# Altium project ESP32.PrjPcb
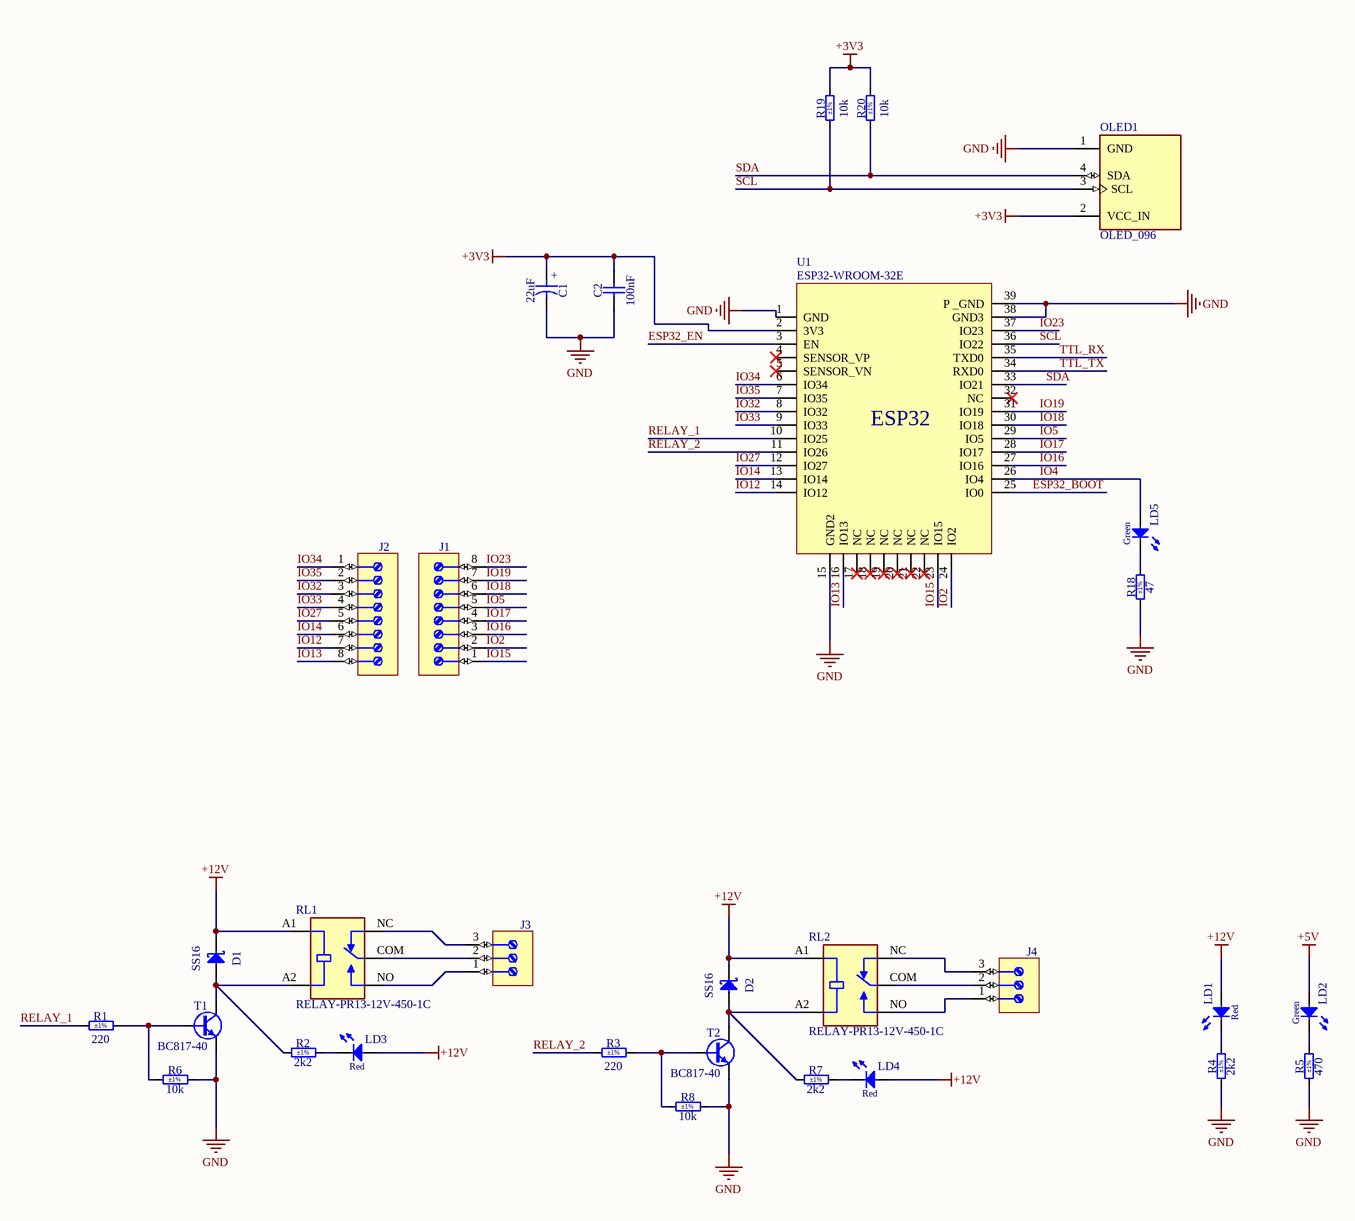
[diagram p0: Core.SchDoc]
3 sheets, 62 parts. Net scope: global (net labels, ports and power ports of the same name join across sheets).
Board file: PCB1.PcbDoc
Sheets:
  Core.SchDoc
  Power.SchDoc
  Com.SchDoc

## Sheet Core.SchDoc
size A3; SheetNumber: 1; SheetTotal: 3

### Parts
C1  22uF  [CAPMP3528X210N]
C2  100nF  [CAPC1608X87N]
D1  SS16  [DIOM5127X229N]
D2  SS16  [DIOM5127X229N]
J1  (no value)  [PHOENIX_1715789]
J2  (no value)  [PHOENIX_1715789]
J3  (no value)  [PHOENIX_1715734]
J4  (no value)  [PHOENIX_1715734]
LD1  Red  [LED_KINGBRIGHT_KPH-1608SURCK]
LD2  Green  [LED_KINGBRIGHT_KP-1608CGCK]
LD3  Red  [LED_KINGBRIGHT_KPH-1608SURCK]
LD4  Red  [LED_KINGBRIGHT_KPH-1608SURCK]
LD5  Green  [LED_KINGBRIGHT_KP-1608CGCK]
OLED1  OLED_096  [OLED096]
R1  220  Tolerance: ±1%  [RESC1608X55N]
R2  2k2  Tolerance: ±1%  [RESC1608X55N]
R3  220  Tolerance: ±1%  [RESC1608X55N]
R4  2k2  Tolerance: ±1%  [RESC1608X55N]
R5  470  Tolerance: ±1%  [RESC1608X55N]
R6  10k  Tolerance: ±1%  [RESC1608X55N]
R7  2k2  Tolerance: ±1%  [RESC1608X55N]
R8  10k  Tolerance: ±1%  [RESC1608X55N]
R18  47  Tolerance: ±1%  [RESC1608X55N]
R19  10k  Tolerance: ±1%  [RESC1608X55N]
R20  10k  Tolerance: ±1%  [RESC1608X55N]
RL1  RELAY-PR13-12V-450-1C  [RELAY_PR13-12V-450-1C]
RL2  RELAY-PR13-12V-450-1C  [RELAY_PR13-12V-450-1C]
T1  BC817-40  [SOT95P230X110-3N]
T2  BC817-40  [SOT95P230X110-3N]
U1  ESP32-WROOM-32E  [ESP32]

### Nets
+3V3: C1.1 C2.2 OLED1.2(VCC_IN) R19.2 R20.2 U1.2(3V3)
+5V: LD2.2(A)
+12V: D1.1(C) D2.1(C) LD1.2(A) LD3.2(A) LD4.2(A) RL1.A1(COIL1) RL2.A1(COIL1)
GND: C1.2 C2.1 OLED1.1(GND) R4.1 R5.1 R6.2 R8.2 R18.1 T1.2(E) T2.2(E) U1.1(GND) U1.15(GND2) U1.38(GND3) U1.39(P__GND)
ESP32_BOOT: U1.25(IO0)
ESP32_EN: U1.3(EN)
IO2: J1.2 U1.24(IO2)
IO4: LD5.2(A) U1.26(IO4)
IO5: J1.5 U1.29(IO5)
IO12: J2.7 U1.14(IO12)
IO13: J2.8 U1.16(IO13)
IO14: J2.6 U1.13(IO14)
IO15: J1.1 U1.23(IO15)
IO16: J1.3 U1.27(IO16)
IO17: J1.4 U1.28(IO17)
IO18: J1.6 U1.30(IO18)
IO19: J1.7 U1.31(IO19)
IO23: J1.8 U1.37(IO23)
IO27: J2.5 U1.12(IO27)
IO32: J2.3 U1.8(IO32)
IO33: J2.4 U1.9(IO33)
IO34: J2.1 U1.6(IO34)
IO35: J2.2 U1.7(IO35)
RELAY_1: R1.1 U1.10(IO25)
RELAY_2: R3.1 U1.11(IO26)
SCL: OLED1.3(SCL) R19.1 U1.36(IO22)
SDA: OLED1.4(SDA) R20.1 U1.33(IO21)
TTL_RX: U1.35(TXD0)
TTL_TX: U1.34(RXD0)
NetD1_2: D1.2(A) R2.1 RL1.A2(COIL2) T1.3(C)
NetD2_2: D2.2(A) R7.1 RL2.A2(COIL2) T2.3(C)
NetJ3_1: J3.1 RL1.NO
NetJ3_2: J3.2 RL1.COM
NetJ3_3: J3.3 RL1.NC
NetJ4_1: J4.1 RL2.NO
NetJ4_2: J4.2 RL2.COM
NetJ4_3: J4.3 RL2.NC
NetLD1_1: LD1.1(C) R4.2
NetLD2_1: LD2.1(C) R5.2
NetLD3_1: LD3.1(C) R2.2
NetLD4_1: LD4.1(C) R7.2
NetLD5_1: LD5.1(C) R18.2
NetR1_2: R1.2 R6.1 T1.1(B)
NetR3_2: R3.2 R8.1 T2.1(B)

Not connected (* = marked no-connect by the designer): U1 4(SENSOR_VP)* 5(SENSOR_VN)* 17(NC)* 18(NC)* 19(NC)* 20(NC)* 21(NC)* 22(NC)* 32(NC)*

### Notes on the sheet
- (in symbol CTE3528-21_22UF_10V_10%_LESR0700) +
- (in symbol ESP32-WROOM-32E) ESP32

### Library data of the parts
C1 = CTE3528-21_22UF_10V_10%_LESR0700: Polarised capacitor; Part Description: Low ESR 0R7 Solid Tantalum Chip Capacitor; Manufacturer: GENERIC; Manufacturer1 Part Number: TPSB226K010R0700; Voltage: 10V; Tolerance: ±10%; Part Number: CTE3528-21_22UF_10V_10%_LESR0700; Component Kind: Standard; Component Type: Standard; Pin Count: 2; Value: 22uF; Status: Preferred; Manufacturer Part Number: CTE3528-21_22UF_10V_10%_LESR0700; Case: B; Mounted: Yes; Socket: No; SMD: Yes; Sense: No; Manufacturer1 Example: AVX; Manufacturer1 ComponentHeight: 2.1mm; HelpURL: \\cern.ch\dfs\Applications\Altium\Datasheets\CTE-LESR_AVX_TPS.pdf; Author: CERN DEM JLC; CreateDate: 5.05.2008; LatestRevisionDate: 20.01.2009
C2 = CC0603_100NF_50V_10%_X5R: Non-polarised capacitor; Part Description: SMD Multilayer Chip Ceramic Capacitor; Manufacturer: GENERIC; Manufacturer1 Part Number: C1608X5R1H104K080; Voltage: 50V; TC: X5R; Tolerance: ±10%; Part Number: CC0603_100NF_50V_10%_X5R; Component Kind: Standard; Component Type: Standard; Pin Count: 2; Value: 100nF; Status: None; Manufacturer Part Number: CC0603_100NF_50V_10%_X5R; Case: 0603; Mounted: Yes; Socket: No; SMD: Yes; Sense: No; Manufacturer1 Example: TDK; Manufacturer1 ComponentHeight: 0.9mm; HelpURL: \\cern.ch\dfs\Applications\Altium\Datasheets\CC0603_X5R_TDK_C.pdf; Author: CERN DEM MR; CreateDate: 8.01.2016; LatestRevisionDate: 8.01.2016
D1 D2 = SS16: Schottky Diode; Part Description: Surface Mount Schottky Barrier Rectifier; Manufacturer: VISHAY GENERAL SEMICONDUCTOR; Voltage: 60V; Power: 1A; PressFit: No; Bonding: No; Part Number: SS16; Component Kind: Standard; Component Type: Standard; Device: SS16; PackageDescription: DO-214-AC/SMA Diode, Molded Body; 5.10mm L X 2.67mm W X 2.29mm H, IPC Medium Density; Manufacturer Part Number: SS16; Pin Count: 2; Case: DO-214AC; Mounted: Yes; Socket: No; SMD: Yes; Sense: No; ComponentHeight: 2.29mm; HelpURL: \\cern.ch\dfs\Applications\Altium\Datasheets\SS16.pdf; Author: CERN DEM JLC; CreateDate: 15.07.2008; LatestRevisionDate: 23.08.2010
J1 J2 = PHOENIX_1715789: Terminal Block, 8 Positions, Screw Connection; Part Description: 17.5A, 400V, Terminal Block, Pitch 5.08mm, 8 Positions, Screw Connection; Manufacturer: PHOENIX CONTACT; Manufacturer Part Number: 1715789 (MKDS 1,5/8-5,08); PressFit: No; Part Number: PHOENIX_1715789; Component Kind: Standard; Component Type: Standard; Pin Count: 8; Mounted: Yes; Socket: No; SMD: No; Sense: No; Status: None; ComponentHeight: 13.8mm; HelpURL: \\cern.ch\dfs\Applications\Altium\Datasheets\PHOENIX_1715789.pdf; Author: CERN DEM JMW; CreateDate: 25.02.2013; LatestRevisionDate: 25.02.2013
J3 J4 = PHOENIX_1715734: Terminal Block, 3 Positions, Screw Connection; Part Description: 17.5A, 400V, Terminal Block, Pitch 5.08mm, 3 Positions, Screw Connection; Manufacturer: PHOENIX CONTACT; Manufacturer Part Number: 1715734 (MKDS 1,5/3-5,08); PressFit: No; Part Number: PHOENIX_1715734; Component Kind: Standard; Component Type: Standard; Pin Count: 3; Mounted: Yes; Socket: No; SMD: No; Sense: No; Status: None; ComponentHeight: 13.8mm; HelpURL: \\cern.ch\dfs\Applications\Altium\Datasheets\PHOENIX_1715734.pdf; Author: CERN DEM JLC; CreateDate: 6.01.2010; LatestRevisionDate: 25.02.2013
LD1 LD3 LD4 = LED_KINGBRIGHT_KPH-1608SURCK: LED Red 1C 2A; Part Description: SMD Hyper Red LED, Case 1.6mmX0.8mm(0603), 0.65mm Thickness; PressFit: No; Bonding: No; Part Number: LED_KINGBRIGHT_KPH-1608SURCK; Component Kind: Standard; Component Type: Standard; Color: Red; PackageDescription: SMT Hyper Red LED, Case 0603, Body L 1.6 x W 0.8mm H 0.65mm; Manufacturer: KINGBRIGHT; Manufacturer Part Number: KPH-1608SURCK; Pin Count: 2; Case: 0603; Mounted: Yes; Socket: No; SMD: Yes; Sense: No; ComponentHeight: 0.65mm; HelpURL: \\cern.ch\dfs\Applications\Altium\Datasheets\LED_KINGBRIGHT_KPH-1608SURCK.pdf; Author: CERN DEM JLC; CreateDate: 3.07.2017; LatestRevisionDate: 3.07.2017
LD2 LD5 = LED_KINGBRIGHT_KP-1608CGCK: LED Green 1C 2A; Part Description: 1.6x0.8mm SMD Chip Green LED Lamp; PressFit: No; Bonding: No; Part Number: LED_KINGBRIGHT_KP-1608CGCK; Component Kind: Standard; Component Type: Standard; Color: Green; PackageDescription: SMT Green LED, Case 0603, Body L 1.60mm x W 0.80mm x H 1.10mm; Manufacturer: KINGBRIGHT; Manufacturer Part Number: KP-1608CGCK; Pin Count: 2; Case: 0603; Mounted: Yes; Socket: No; SMD: Yes; Sense: No; ComponentHeight: 1.1mm; HelpURL: \\cern.ch\dfs\Applications\Altium\Datasheets\LED_KINGBRIGHT_KP-1608CGCK.pdf; Author: CERN DEM HF; CreateDate: 1.10.2021; LatestRevisionDate: 1.10.2021
R1 R3 = R0603_220R_1%_0.1W_100PPM: Resistor - 1%; Part Description: General Purpose Thick Film Chip Resistor; Manufacturer: GENERIC; Manufacturer1 Part Number: NRC06F2200TRF; Power: 0.1W; TC: ±100ppm/°C; PressFit: No; Part Number: R0603_220R_1%_0.1W_100PPM; Component Kind: Standard; Component Type: Standard; Pin Count: 2; Value: 220; Status: Preferred; Manufacturer Part Number: R0603_220R_1%_0.1W_100PPM; Case: 0603; Mounted: Yes; Sense: No; Socket: No; SMD: Yes; Manufacturer1 Example: NIC COMPONENT; Manufacturer1 ComponentHeight: 0.55mm; HelpURL: \\cern.ch\dfs\Applications\Altium\Datasheets\R0603_NIC_NRC.pdf; Author: CERN DEM JLC; CreateDate: 3.12.2007; LatestRevisionDate: 13.03.2008
R2 R4 R7 = R0603_2K2_1%_0.1W_100PPM: Resistor - 1%; Part Description: General Purpose Thick Film Chip Resistor; Manufacturer: GENERIC; Manufacturer1 Part Number: NRC06F2201TRF; Power: 0.1W; TC: ±100ppm/°C; PressFit: No; Part Number: R0603_2K2_1%_0.1W_100PPM; Component Kind: Standard; Component Type: Standard; Pin Count: 2; Value: 2k2; Status: Preferred; Manufacturer Part Number: R0603_2K2_1%_0.1W_100PPM; Case: 0603; Mounted: Yes; Sense: No; Socket: No; SMD: Yes; Manufacturer1 Example: NIC COMPONENT; Manufacturer1 ComponentHeight: 0.55mm; HelpURL: \\cern.ch\dfs\Applications\Altium\Datasheets\R0603_NIC_NRC.pdf; Author: CERN DEM JLC; CreateDate: 3.12.2007; LatestRevisionDate: 13.03.2008
R5 = R0603_470R_1%_0.1W_100PPM: Resistor - 1%; Part Description: General Purpose Thick Film Chip Resistor; Manufacturer: GENERIC; Manufacturer1 Part Number: NRC06F4700TRF; Power: 0.1W; TC: ±100ppm/°C; PressFit: No; Part Number: R0603_470R_1%_0.1W_100PPM; Component Kind: Standard; Component Type: Standard; Pin Count: 2; Value: 470; Status: Preferred; Manufacturer Part Number: R0603_470R_1%_0.1W_100PPM; Case: 0603; Mounted: Yes; Sense: No; Socket: No; SMD: Yes; Manufacturer1 Example: NIC COMPONENT; Manufacturer1 ComponentHeight: 0.55mm; HelpURL: \\cern.ch\dfs\Applications\Altium\Datasheets\R0603_NIC_NRC.pdf; Author: CERN DEM JLC; CreateDate: 3.12.2007; LatestRevisionDate: 13.03.2008
R6 R8 R19 R20 = R0603_10K_1%_0.1W_100PPM: Resistor - 1%; Part Description: General Purpose Thick Film Chip Resistor; Manufacturer: GENERIC; Manufacturer1 Part Number: NRC06F1002TRF; Power: 0.1W; TC: ±100ppm/°C; PressFit: No; Part Number: R0603_10K_1%_0.1W_100PPM; Component Kind: Standard; Component Type: Standard; Pin Count: 2; Value: 10k; Status: Preferred; Manufacturer Part Number: R0603_10K_1%_0.1W_100PPM; Case: 0603; Mounted: Yes; Sense: No; Socket: No; SMD: Yes; Manufacturer1 Example: NIC COMPONENT; Manufacturer1 ComponentHeight: 0.55mm; HelpURL: \\cern.ch\dfs\Applications\Altium\Datasheets\R0603_NIC_NRC.pdf; Author: CERN DEM JLC; CreateDate: 3.12.2007; LatestRevisionDate: 13.03.2008
R18 = R0603_47R_1%_0.1W_100PPM: Resistor - 1%; Part Description: General Purpose Thick Film Chip Resistor; Manufacturer: GENERIC; Manufacturer1 Part Number: NRC06F47R0TRF; Power: 0.1W; TC: ±100ppm/°C; PressFit: No; Part Number: R0603_47R_1%_0.1W_100PPM; Component Kind: Standard; Component Type: Standard; Pin Count: 2; Value: 47; Status: Preferred; Manufacturer Part Number: R0603_47R_1%_0.1W_100PPM; Case: 0603; Mounted: Yes; Sense: No; Socket: No; SMD: Yes; Manufacturer1 Example: NIC COMPONENT; Manufacturer1 ComponentHeight: 0.55mm; HelpURL: \\cern.ch\dfs\Applications\Altium\Datasheets\R0603_NIC_NRC.pdf; Author: CERN DEM JLC; CreateDate: 3.12.2007; LatestRevisionDate: 13.03.2008
T1 T2 = BC817-40: NPN Transistor; Part Description: 45V 500mA NPN General-Purpose Transistor; Manufacturer: NXP SEMICONDUCTORS; PressFit: No; Bonding: No; Part Number: BC817-40; Component Kind: Standard; Component Type: Standard; Device: BC817-40; PackageDescription: SOT23, 0.95mm Pitch; 3 Pin, 1.30mm W X 2.90mm L X 1.10mm H body, IPC Medium Density; Manufacturer Part Number: BC817-40; Pin Count: 3; Case: SOT23-3; Mounted: Yes; Socket: No; SMD: Yes; Sense: No; ComponentHeight: 1.1mm; HelpURL: \\cern.ch\dfs\Applications\Altium\Datasheets\BC817-40.pdf; Author: CERN DEM BC; CreateDate: 29.04.2020; LatestRevisionDate: 29.04.2020

## Sheet Power.SchDoc
size A4; SheetNumber: 2; SheetTotal: 3
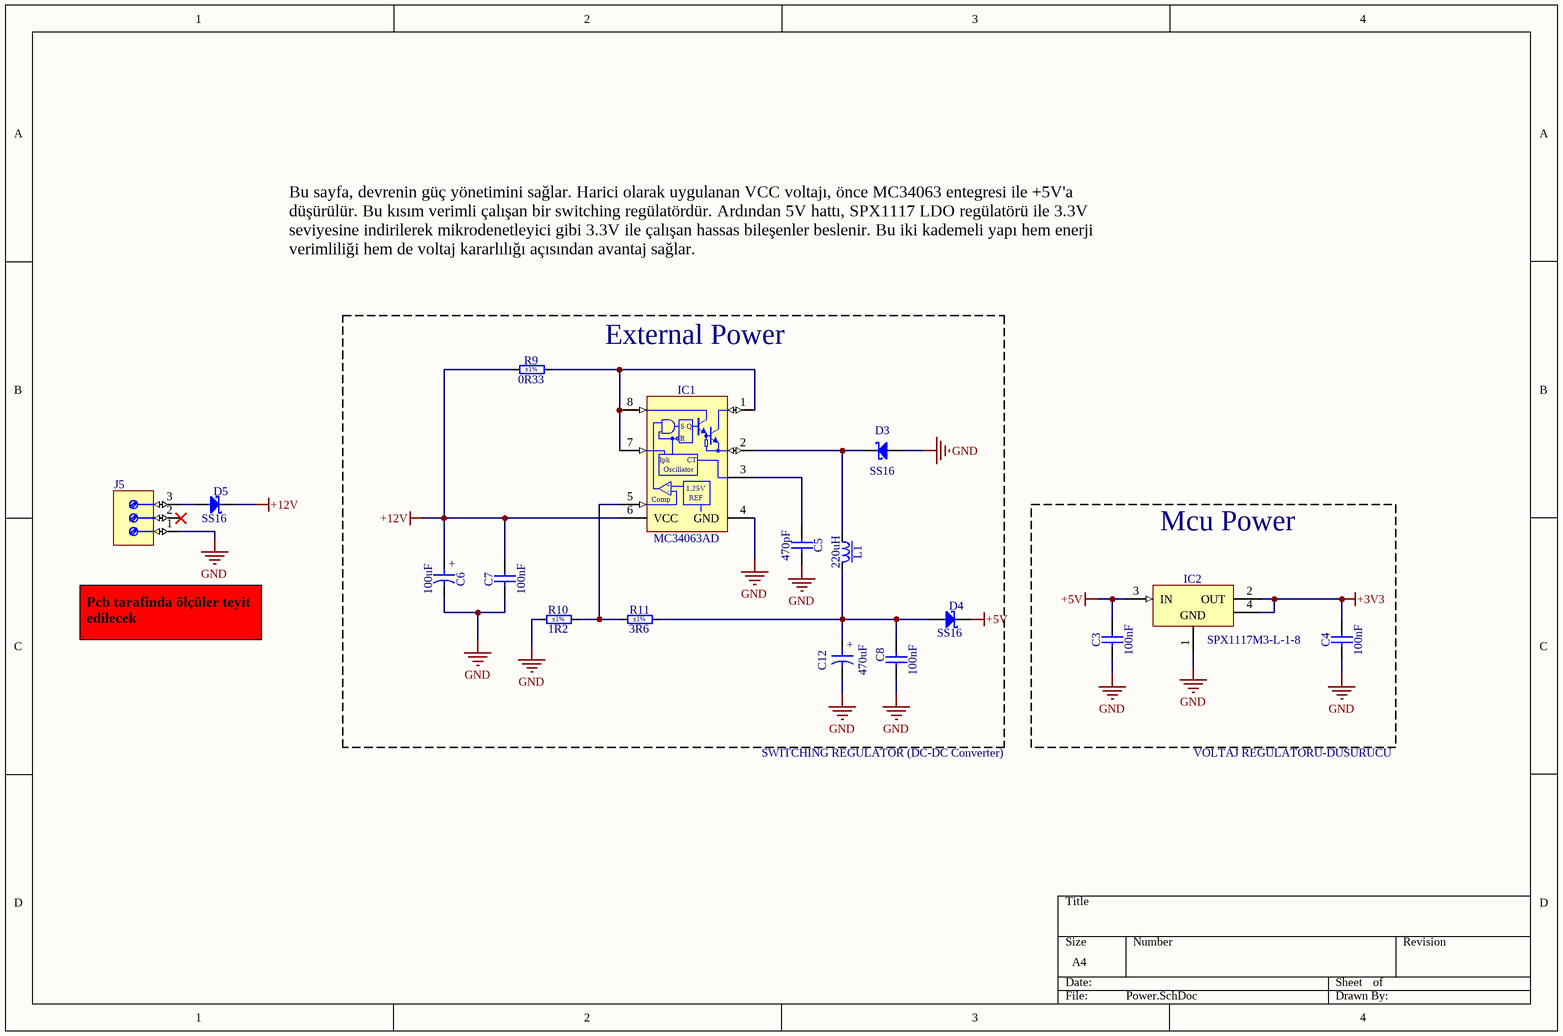
[diagram p1: Power.SchDoc]

### Parts
C3  100nF  [CAPC1608X87N]
C4  100nF  [CAPC1608X87N]
C5  470pF  [CAPC1608X87N]
C6  100uF  [CAPMP7343X430N]
C7  100nF  [CAPC1608X87N]
C8  100nF  [CAPC1608X87N]
C12  470uF  [CAPMP7343X310N]
D3  SS16  [DIOM5127X229N]
D4  SS16  [DIOM5127X229N]
D5  SS16  [DIOM5127X229N]
IC1  MC34063AD  [SOIC127P600X175-8N]
IC2  SPX1117M3-L-1-8  [SOT230P700X180-4N]
J5  (no value)  [PHOENIX_1715734]
L1  220uH  [IND_EPCOS_B82464-G4]
R9  0R33  Tolerance: ±1%  [RESC3216X65N]
R10  1R2  Tolerance: ±1%  [RESC1608X55N]
R11  3R6  Tolerance: ±1%  [RESC1608X55N]

### Blocks framed on the sheet
External Power: C5-C8 C12 D3 D4 IC1 L1 R9-R11
Mcu Power: C3 C4 IC2

### Nets
+3V3: C4.2 IC2.2(OUT) IC2.4(OUT)
+5V: C3.2 D4.1(C) IC2.3(IN)
+12V: C6.1 C7.2 D5.1(C) IC1.6(VCC) R9.1
GND: C3.1 C4.1 C5.2 C6.2 C7.1 C8.1 C12.2 D3.2(A) IC1.4(GND) IC2.1(GND) J5.1 R10.1
NetC5_1: C5.1 IC1.3(TC)
NetC8_2: C8.2 C12.1 D4.2(A) L1.2 R11.2
NetD3_1: D3.1(C) IC1.2(SWE) L1.1
NetD5_2: D5.2(A) J5.3
NetIC1_1: IC1.1(SWC) IC1.7(Ipk) IC1.8(DRVC) R9.2
NetIC1_5: IC1.5(COMP) R10.2 R11.1

Not connected (* = marked no-connect by the designer): J5 2*

### Notes on the sheet
- Bu sayfa, devrenin güç yönetimini sağlar. Harici olarak uygulanan VCC voltajı, önce MC34063 entegresi ile +5V'a düşürülür. Bu kısım verimli çalışan bir switching regülatördür. Ardından 5V hattı, SPX1117 LDO regülatörü ile 3.3V seviyesine indirilerek mikrodenetleyici gibi 3.3V ile çalışan hassas bileşenler beslenir. Bu iki kademeli yapı hem enerji verimliliği hem de voltaj kararlılığı açısından avantaj sağlar.
- Pcb tarafinda ölçüler teyit edilecek
- SWITCHING REGULATOR (DC-DC Converter)
- VOLTAJ REGULATORU-DUSURUCU
- (in symbol CTE7343-31_470UF_6.3V_10%) +
- (in symbol CTE7343-43_100UF_20V_10%_LESR0150) +
- (in symbol MC34063AD) S; Q; R; CT; Oscillator; +; -; 1.25V; Comp; REF

### Library data of the parts
C3 C4 C7 C8 = CC0603_100NF_50V_10%_X5R: as C2 on sheet Core; Part Number: CC0603_100NF_50V_10%_X5R; Component Kind: Standard; Component Type: Standard; Pin Count: 2; Value: 100nF; Status: None; Manufacturer Part Number: CC0603_100NF_50V_10%_X5R; Case: 0603; Mounted: Yes; Socket: No; SMD: Yes; Sense: No; Manufacturer1 Example: TDK; Manufacturer1 ComponentHeight: 0.9mm; HelpURL: \\cern.ch\dfs\Applications\Altium\Datasheets\CC0603_X5R_TDK_C.pdf; Author: CERN DEM MR; CreateDate: 8.01.2016; LatestRevisionDate: 8.01.2016
C5 = CC0603_470PF_50V_5%_NP0: Non-polarised capacitor; Part Description: SMD Multilayer Chip Ceramic Capacitor; Manufacturer: GENERIC; Manufacturer1 Part Number: 223886715471; Voltage: 50V; TC: C0G/NP0; Tolerance: ±5%; Part Number: CC0603_470PF_50V_5%_NP0; Component Kind: Standard; Component Type: Standard; Pin Count: 2; Value: 470pF; Status: Preferred; Manufacturer Part Number: CC0603_470PF_50V_5%_NP0; Case: 0603; Mounted: Yes; Socket: No; SMD: Yes; Sense: No; Manufacturer1 Example: PHYCOMP; Manufacturer1 ComponentHeight: 0.87mm; HelpURL: \\cern.ch\dfs\Applications\Altium\Datasheets\CC0603_NP0_PHYCOMP.pdf; Author: CERN DEM JLC; CreateDate: 3.12.2007; LatestRevisionDate: 3.12.2007
C6 = CTE7343-43_100UF_20V_10%_LESR0150: Polarised capacitor; Part Description: Low ESR 0R15 Solid Tantalum Chip Capacitor; Manufacturer: GENERIC; Manufacturer1 Part Number: TPSE107K020R0150; Voltage: 20V; Tolerance: ±10%; Part Number: CTE7343-43_100UF_20V_10%_LESR0150; Component Kind: Standard; Component Type: Standard; Pin Count: 2; Value: 100uF; Status: Preferred; Manufacturer Part Number: CTE7343-43_100UF_20V_10%_LESR0150; Case: E; Mounted: Yes; Socket: No; SMD: Yes; Sense: No; Manufacturer1 Example: AVX; Manufacturer1 ComponentHeight: 4.3mm; HelpURL: \\cern.ch\dfs\Applications\Altium\Datasheets\CTE-LESR_AVX_TPS.pdf; Author: CERN DEM JLC; CreateDate: 5.05.2008; LatestRevisionDate: 20.01.2009
C12 = CTE7343-31_470UF_6.3V_10%: Polarised capacitor; Part Description: Solid Tantalum Chip Capacitor; Manufacturer: GENERIC; Manufacturer1 Part Number: TAJD477K006R; Voltage: 6.3V; Tolerance: ±10%; Part Number: CTE7343-31_470UF_6.3V_10%; Component Kind: Standard; Component Type: Standard; Pin Count: 2; Value: 470uF; Status: Preferred; Manufacturer Part Number: CTE7343-31_470UF_6.3V_10%; Case: D; Mounted: Yes; Socket: No; SMD: Yes; Sense: No; Manufacturer1 Example: AVX; Manufacturer1 ComponentHeight: 3.1mm; HelpURL: \\cern.ch\dfs\Applications\Altium\Datasheets\CTE_AVX_TAJ.pdf; Author: CERN DEM JLC; CreateDate: 3.12.2007; LatestRevisionDate: 3.12.2007
D3-D5 = SS16: as D1 on sheet Core; Part Number: SS16; Component Kind: Standard; Component Type: Standard; Device: SS16; PackageDescription: DO-214-AC/SMA Diode, Molded Body; 5.10mm L X 2.67mm W X 2.29mm H, IPC Medium Density; Manufacturer Part Number: SS16; Pin Count: 2; Case: DO-214AC; Mounted: Yes; Socket: No; SMD: Yes; Sense: No; ComponentHeight: 2.29mm; HelpURL: \\cern.ch\dfs\Applications\Altium\Datasheets\SS16.pdf; Author: CERN DEM JLC; CreateDate: 15.07.2008; LatestRevisionDate: 23.08.2010
IC1 = MC34063AD: 3V to 40V 1.5A Peak Boost/Buck/Inverting Switching Regulator; Manufacturer: TEXAS INSTRUMENTS; PressFit: No; Bonding: No; Part Number: MC34063AD; Component Kind: Standard; Component Type: Standard; Device: MC34063AD; PackageDescription: SOIC 8, Pitch 1.27mm, Body 4x5mm, IPC Medium Density; Part Description: 3V to 40V 1.5A Peak Boost/Buck/Inverting Switching Regulator; Manufacturer Part Number: MC34063AD; Pin Count: 8; Case: SOIC8; Mounted: Yes; Socket: No; SMD: Yes; Sense: No; ComponentHeight: 1.75mm; HelpURL: \\cern.ch\dfs\Applications\Altium\Datasheets\MC34063AD.pdf; Author: CERN DEM JLC; CreateDate: 27.10.2009; LatestRevisionDate: 27.10.2009
IC2 = SPX1117M3-L-1-8: 3-Terminal Regulator 1=GND 2=OUT 3=IN 4=OUT; Part Description: 1.8V 800mA Low Dropout Voltage Regulator; Manufacturer: EXAR; PressFit: No; Bonding: No; Part Number: SPX1117M3-L-1-8; Component Kind: Standard; Component Type: Standard; Device: SPX1117M3-L-1-8; PackageDescription: SOT223, 2.30mm Pitch; 4 Pin, 3.70mm W X 6.70mm L X 1.80mm H body, IPC Medium Density; Manufacturer Part Number: SPX1117M3-L-1-8; Pin Count: 4; Case: SOT223; Mounted: Yes; Socket: No; SMD: Yes; Sense: No; ComponentHeight: 1.8mm; HelpURL: \\cern.ch\dfs\Applications\Altium\Datasheets\SPX1117M3-L-1-8.pdf; Author: CERN DEM JLC; CreateDate: 5.07.2011; LatestRevisionDate: 5.07.2011
J5 = PHOENIX_1715734: as J3 on sheet Core; Part Number: PHOENIX_1715734; Component Kind: Standard; Component Type: Standard; Pin Count: 3; Mounted: Yes; Socket: No; SMD: No; Sense: No; Status: None; ComponentHeight: 13.8mm; HelpURL: \\cern.ch\dfs\Applications\Altium\Datasheets\PHOENIX_1715734.pdf; Author: CERN DEM JLC; CreateDate: 6.01.2010; LatestRevisionDate: 25.02.2013
L1 = IND_470UH_20%_EPCOS_B82464-G4: Inductor With Core; Part Description: SMT Power Inductor; Manufacturer: EPCOS; Manufacturer Part Number: B82464–G4474–M; Value: 470uH; Power: 0.5A; Resistance: 0.93R; Tolerance: ±20%; Part Number: IND_470UH_20%_EPCOS_B82464-G4; Component Kind: Standard; Component Type: Standard; Pin Count: 2; Mounted: Yes; Socket: No; SMD: Yes; Sense: No; ComponentHeight: 4.8mm; HelpURL: \\cern.ch\dfs\Applications\Altium\Datasheets\IND_EPCOS_B82464-G4.pdf; Author: CERN DEM JLC; CreateDate: 17.11.2008; LatestRevisionDate: 17.11.2008
R9 = R1206_0R33_1%_0.5W_600PPM: Resistor - 1%; Part Description: Low Ohmique High Power Chip Resistor; Manufacturer: YAGEO PHYCOMP; Manufacturer Part Number: RL1206FR-7W0R33 (235051913307); Power: 0.5W; TC: ±600ppm/°C; PressFit: No; Part Number: R1206_0R33_1%_0.5W_600PPM; Component Kind: Standard; Component Type: Standard; Pin Count: 2; Value: 0R33; Status: Not Recommended; Case: 1206; Mounted: Yes; Sense: No; Socket: No; SMD: Yes; ComponentHeight: 0.65mm; HelpURL: \\cern.ch\dfs\Applications\Altium\Datasheets\R1206_PHYCOMP_LRC02P.pdf; Author: CERN DEM JMW; CreateDate: 6.01.2009; LatestRevisionDate: 6.01.2009
R10 = R0603_1R2_1%_0.1W_200PPM: Resistor - 1%; Part Description: General Purpose Thick Film Chip Resistor; Manufacturer: GENERIC; Manufacturer1 Part Number: 232270461208L or RC0603FR-071R2L; Power: 0.1W; TC: ±200ppm/°C; PressFit: No; Part Number: R0603_1R2_1%_0.1W_200PPM; Component Kind: Standard; Component Type: Standard; Pin Count: 2; Value: 1R2; Status: Preferred; Manufacturer Part Number: R0603_1R2_1%_0.1W_200PPM; Case: 0603; Mounted: Yes; Sense: No; Socket: No; SMD: Yes; Manufacturer1 Example: YAGEO PHYCOMP; Manufacturer1 ComponentHeight: 0.65mm; HelpURL: \\cern.ch\dfs\Applications\Altium\Datasheets\R0603_Phycomp_RC0603.pdf; Author: CERN DEM JLC; CreateDate: 3.12.2007; LatestRevisionDate: 17.10.2012
R11 = R0603_3R6_1%_0.1W_200PPM: Resistor - 1%; Part Description: General Purpose Thick Film Chip Resistor; Manufacturer: GENERIC; Manufacturer1 Part Number: 232270463608L or RC0603FR-073R6L; Power: 0.1W; TC: ±200ppm/°C; PressFit: No; Part Number: R0603_3R6_1%_0.1W_200PPM; Component Kind: Standard; Component Type: Standard; Pin Count: 2; Value: 3R6; Status: Preferred; Manufacturer Part Number: R0603_3R6_1%_0.1W_200PPM; Case: 0603; Mounted: Yes; Sense: No; Socket: No; SMD: Yes; Manufacturer1 Example: YAGEO PHYCOMP; Manufacturer1 ComponentHeight: 0.65mm; HelpURL: \\cern.ch\dfs\Applications\Altium\Datasheets\R0603_Phycomp_RC0603.pdf; Author: CERN DEM JLC; CreateDate: 3.12.2007; LatestRevisionDate: 17.10.2012

## Sheet Com.SchDoc
size A3; SheetNumber: 3; SheetTotal: 3
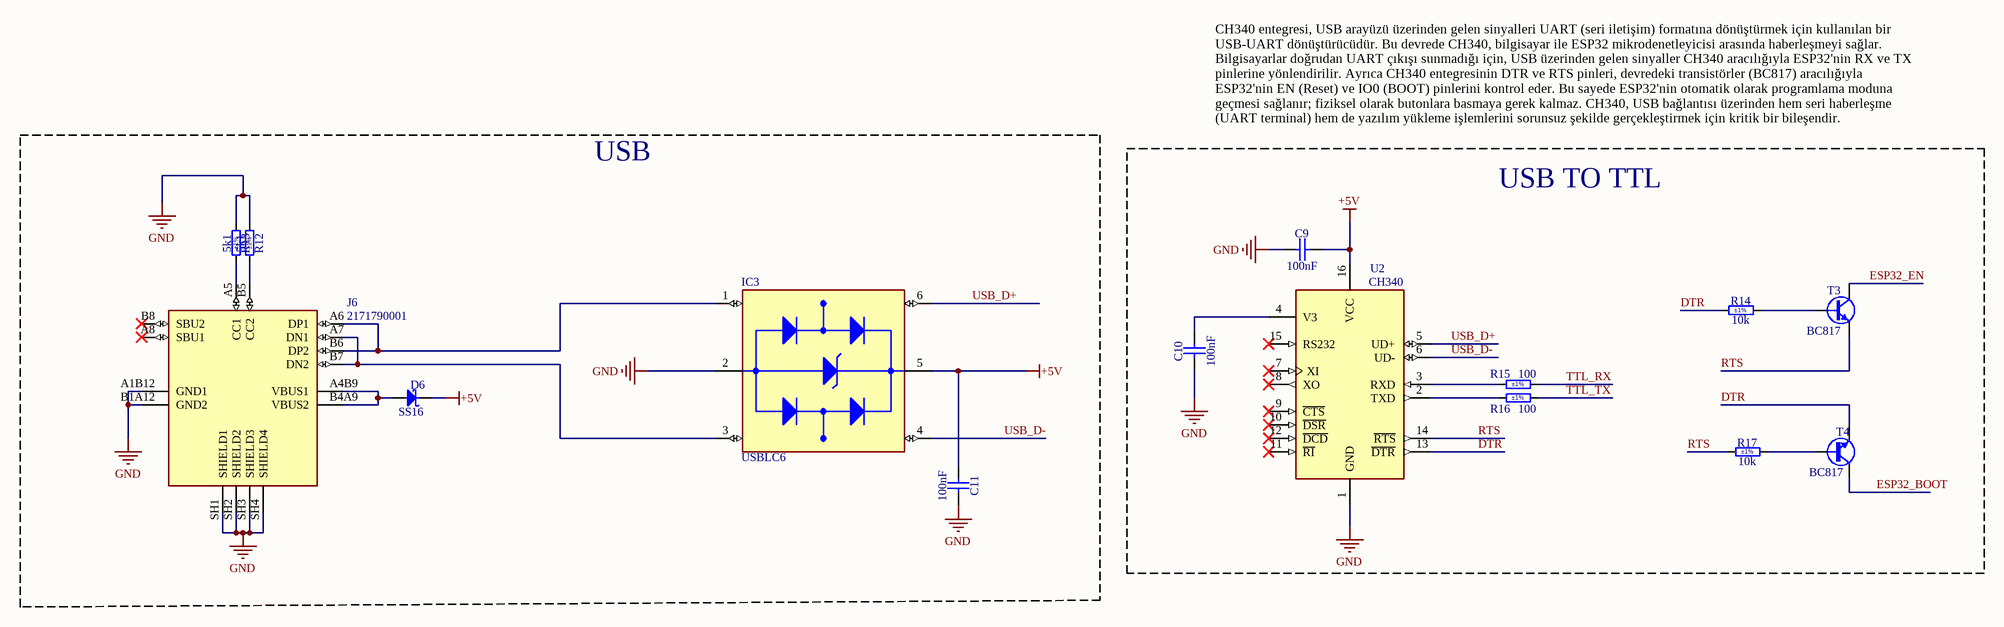
[diagram p2: Com.SchDoc]

### Parts
C9  100nF  [CAPC1608X87N]
C10  100nF  [CAPC1608X87N]
C11  100nF  [CAPC1608X87N]
D6  SS16  [DIOM5127X229N]
IC3  USBLC6  [USBC6]
J6  2171790001  [TYPEC]
R12  5k1  Tolerance: ±1%  [RESC1608X55N]
R13  5k1  Tolerance: ±1%  [RESC1608X55N]
R14  10k  Tolerance: ±1%  [RESC1608X55N]
R15  100  Tolerance: ±1%  [RESC1608X55N]
R16  100  Tolerance: ±1%  [RESC1608X55N]
R17  10k  Tolerance: ±1%  [RESC1608X55N]
T3  BC817  [SOT95P230X110-3N]
T4  BC817  [SOT95P230X110-3N]
U2  CH340  [CH340]

### Blocks framed on the sheet
USB: C11 D6 IC3 J6 R12 R13
USB TO TTL: C9 C10 R14-R17 T3 T4 U2

### Nets
+5V: C9.2 C11.2 D6.1(C) IC3.5(VBUS) U2.16(VCC)
GND: C9.1 C10.1 C11.1 IC3.2(GND) J6.A1B12(GND1) J6.B1A12(GND2) J6.SH1(SHIELD1) J6.SH2(SHIELD2) J6.SH3(SHIELD3) J6.SH4(SHIELD4) R12.2 R13.2 U2.1(GND)
DTR: R14.1 T4.2(E) U2.13(~{DTR})
ESP32_BOOT: T4.3(C)
ESP32_EN: T3.3(C)
RTS: R17.1 T3.2(E) U2.14(~{RTS})
TTL_RX: R15.2
TTL_TX: R16.2
USB_D+: IC3.6(I/O1_OUT) U2.5(UD+)
USB_D-: IC3.4(I/O2_OUT) U2.6(UD-)
NetC10_2: C10.2 U2.4(V3)
NetD6_2: D6.2(A) J6.A4B9(VBUS1) J6.B4A9(VBUS2)
NetIC3_1: IC3.1(I/O1_IN) J6.A6(DP1) J6.B6(DP2)
NetIC3_3: IC3.3(I/O2_IN) J6.A7(DN1) J6.B7(DN2)
NetJ6_A5: J6.A5(CC1) R13.1
NetJ6_B5: J6.B5(CC2) R12.1
NetR14_2: R14.2 T3.1(B)
NetR15_1: R15.1 U2.3(RXD)
NetR16_1: R16.1 U2.2(TXD)
NetR17_2: R17.2 T4.1(B)

Not connected (* = marked no-connect by the designer): J6 A8(SBU1)* B8(SBU2)*; U2 7(XI)* 8(XO)* 9(~{CTS})* 10(~{DSR})* 11(~{RI})* 12(~{DCD})* 15(RS232)*

### Notes on the sheet
- CH340 entegresi, USB arayüzü üzerinden gelen sinyalleri UART (seri iletişim) formatına dönüştürmek için kullanılan bir USB-UART dönüştürücüdür. Bu devrede CH340, bilgisayar ile ESP32 mikrodenetleyicisi arasında haberleşmeyi sağlar. Bilgisayarlar doğrudan UART çıkışı sunmadığı için, USB üzerinden gelen sinyaller CH340 aracılığıyla ESP32'nin RX ve TX pinlerine yönlendirilir. Ayrıca CH340 entegresinin DTR ve RTS pinleri, devredeki transistörler (BC817) aracılığıyla ESP32'nin EN (Reset) ve IO0 (BOOT) pinlerini kontrol eder. Bu sayede ESP32'nin otomatik olarak programlama moduna geçmesi sağlanır; fiziksel olarak butonlara basmaya gerek kalmaz. CH340, USB bağlantısı üzerinden hem seri haberleşme (UART terminal) hem de yazılım yükleme işlemlerini sorunsuz şekilde gerçekleştirmek için kritik bir bileşendir.

### Library data of the parts
C9-C11 = CC0603_100NF_50V_10%_X5R: as C2 on sheet Core; Part Number: CC0603_100NF_50V_10%_X5R; Component Kind: Standard; Component Type: Standard; Pin Count: 2; Value: 100nF; Status: None; Manufacturer Part Number: CC0603_100NF_50V_10%_X5R; Case: 0603; Mounted: Yes; Socket: No; SMD: Yes; Sense: No; Manufacturer1 Example: TDK; Manufacturer1 ComponentHeight: 0.9mm; HelpURL: \\cern.ch\dfs\Applications\Altium\Datasheets\CC0603_X5R_TDK_C.pdf; Author: CERN DEM MR; CreateDate: 8.01.2016; LatestRevisionDate: 8.01.2016
D6 = SS16: as D1 on sheet Core; Part Number: SS16; Component Kind: Standard; Component Type: Standard; Device: SS16; PackageDescription: DO-214-AC/SMA Diode, Molded Body; 5.10mm L X 2.67mm W X 2.29mm H, IPC Medium Density; Manufacturer Part Number: SS16; Pin Count: 2; Case: DO-214AC; Mounted: Yes; Socket: No; SMD: Yes; Sense: No; ComponentHeight: 2.29mm; HelpURL: \\cern.ch\dfs\Applications\Altium\Datasheets\SS16.pdf; Author: CERN DEM JLC; CreateDate: 15.07.2008; LatestRevisionDate: 23.08.2010
J6 = TypeC USB2.0 16pin SMD
R12 R13 = R0603_5K1_1%_0.1W_100PPM: Resistor - 1%; Part Description: General Purpose Thick Film Chip Resistor; Manufacturer: GENERIC; Manufacturer1 Part Number: NRC06F5101TRF; Power: 0.1W; TC: ±100ppm/°C; PressFit: No; Part Number: R0603_5K1_1%_0.1W_100PPM; Component Kind: Standard; Component Type: Standard; Pin Count: 2; Value: 5k1; Status: Preferred; Manufacturer Part Number: R0603_5K1_1%_0.1W_100PPM; Case: 0603; Mounted: Yes; Sense: No; Socket: No; SMD: Yes; Manufacturer1 Example: NIC COMPONENT; Manufacturer1 ComponentHeight: 0.55mm; HelpURL: \\cern.ch\dfs\Applications\Altium\Datasheets\R0603_NIC_NRC.pdf; Author: CERN DEM JLC; CreateDate: 3.12.2007; LatestRevisionDate: 13.03.2008
R14 R17 = R0603_10K_1%_0.1W_100PPM: as R6 on sheet Core; Part Number: R0603_10K_1%_0.1W_100PPM; Component Kind: Standard; Component Type: Standard; Pin Count: 2; Value: 10k; Status: Preferred; Manufacturer Part Number: R0603_10K_1%_0.1W_100PPM; Case: 0603; Mounted: Yes; Sense: No; Socket: No; SMD: Yes; Manufacturer1 Example: NIC COMPONENT; Manufacturer1 ComponentHeight: 0.55mm; HelpURL: \\cern.ch\dfs\Applications\Altium\Datasheets\R0603_NIC_NRC.pdf; Author: CERN DEM JLC; CreateDate: 3.12.2007; LatestRevisionDate: 13.03.2008
R15 R16 = R0603_100R_1%_0.1W_100PPM: Resistor - 1%; Part Description: General Purpose Thick Film Chip Resistor; Manufacturer: GENERIC; Manufacturer1 Part Number: NRC06F4700TRF; Power: 0.1W; TC: ±100ppm/°C; PressFit: No; Part Number: R0603_100R_1%_0.1W_100PPM; Component Kind: Standard; Component Type: Standard; Pin Count: 2; Value: 100; Status: Preferred; Manufacturer Part Number: R0603_100R_1%_0.1W_100PPM; Case: 0603; Mounted: Yes; Sense: No; Socket: No; SMD: Yes; Manufacturer1 Example: NIC COMPONENT; Manufacturer1 ComponentHeight: 0.55mm; HelpURL: \\cern.ch\dfs\Applications\Altium\Datasheets\R0603_NIC_NRC.pdf; Author: CERN DEM JLC; CreateDate: 3.12.2007; LatestRevisionDate: 13.03.2008
T3 T4 = BC817: NPN Transistor; Part Description: 45V 500mA NPN General-Purpose Transistor; Manufacturer: NXP SEMICONDUCTORS; PressFit: No; Bonding: No; Part Number: BC817; Component Kind: Standard; Component Type: Standard; Device: BC817; PackageDescription: SOT23, 0.95mm Pitch; 3 Pin, 1.30mm W X 2.90mm L X 1.10mm H body, IPC Medium Density; Manufacturer Part Number: BC817; Pin Count: 3; Case: SOT23-3; Mounted: Yes; Socket: No; SMD: Yes; Sense: No; ComponentHeight: 1.1mm; HelpURL: \\cern.ch\dfs\Applications\Altium\Datasheets\BC817.pdf; Author: CERN DEM JLC; CreateDate: 12.05.2011; LatestRevisionDate: 12.05.2011

## Nets that join several sheets
+3V3: Core (6 pins), Power (C4.2 IC2.2 IC2.4)
+5V: Core (LD2.2), Power (C3.2 D4.1 IC2.3), Com (5 pins)
+12V: Core (7 pins), Power (5 pins)
GND: Core (14 pins), Power (12 pins), Com (13 pins)
ESP32_BOOT: Core (U1.25), Com (T4.3)
ESP32_EN: Core (U1.3), Com (T3.3)
TTL_RX: Core (U1.35), Com (R15.2)
TTL_TX: Core (U1.34), Com (R16.2)